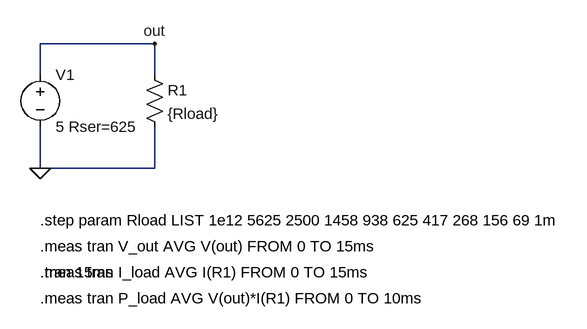
[diagram p0: schematic lab.asc]
lab.asc, the LTspice schematic file:
Version 4.1
SHEET 1 880 680
WIRE 288 48 112 48    ; Top horizontal wire (V1 pin to R1 pin)
WIRE 112 96 112 48    ; Top-left vertical segment to V1 top pin
WIRE 288 96 288 48    ; Top-right vertical segment to R1 top pin
WIRE 112 240 112 176  ; Bottom-left segment from V1 bottom pin
WIRE 288 240 288 176  ; Bottom-right segment from R1 bottom pin
WIRE 288 240 112 240  ; Bottom horizontal wire (V1 ground to R1 ground)
FLAG 112 240 0
FLAG 288 48 out
SYMBOL voltage 112 80 R0
SYMATTR InstName V1
SYMATTR Value 5 Rser=625
SYMBOL res 272 80 R0
SYMATTR InstName R1
SYMATTR Value {Rload}
TEXT 112 320 Left 2 !.step param Rload LIST 1e12 5625 2500 1458 938 625 417 268 156 69 1m
TEXT 112 360 Left 2 !.meas tran V_out AVG V(out) FROM 0 TO 15ms
TEXT 112 400 Left 2 !.meas tran I_load AVG I(R1) FROM 0 TO 15ms
TEXT 112 440 Left 2 !.meas tran P_load AVG V(out)*I(R1) FROM 0 TO 10ms
TEXT 112 400 Left 2 !.tran 15ms

The netlist it stands for:
* lab.asc
V1 out 0 5 Rser=625
R1 out 0 {Rload}
.step param Rload LIST 1e12 5625 2500 1458 938 625 417 268 156 69 1m
.meas tran V_out AVG V(out) FROM 0 TO 15ms
.meas tran I_load AVG I(R1) FROM 0 TO 15ms
.meas tran P_load AVG V(out)*I(R1) FROM 0 TO 10ms
.tran 15ms
.backanno
.end